# EAGLE schematic zero crossing (EAGLE 7.2.0)
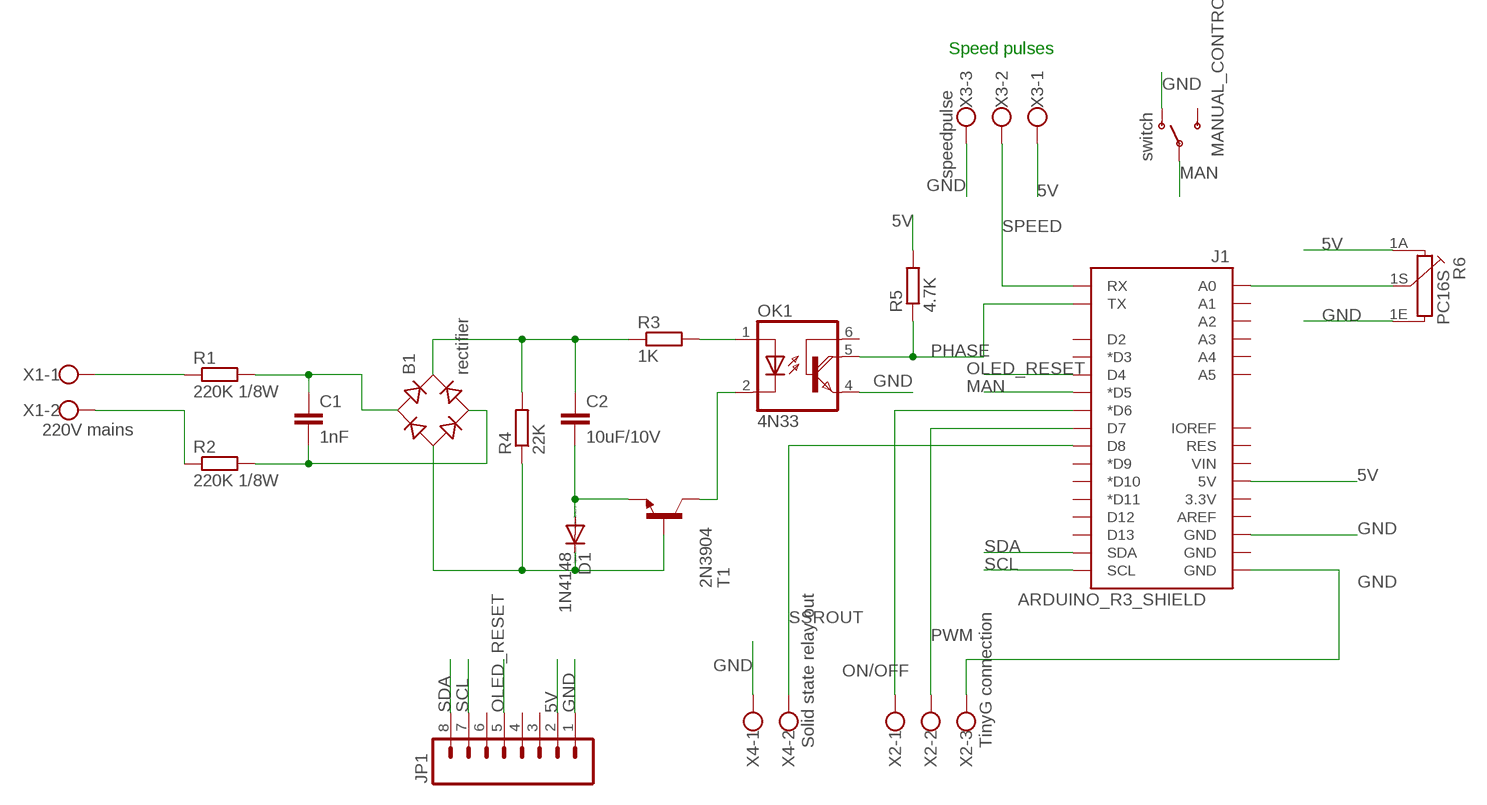
[diagram p0: schematic, sheet 1]

## Parts
B1  rectifier  RB1A  [RB1A]
C1  1nF  C-EU050-025X075  [C050-025X075]
C2  10uF/10V  C-EU050-025X075  [C050-025X075]
D1  1N4148  1N4148DO35-7  [DO35-7]
J1  ARDUINO_R3_SHIELD  [UNO_R3_SHIELD]
JP1  M08LOCK_LONGPADS  [1X08_LOCK_LONGPADS]
MANUAL_CONTROL  switch  SWITCH-SPDTPTH  [SWITCH-SPDT]
OK1  4N33  [DIL06]
R1  220K 1/8W  R-EU_0207/10  [0207/10]
R2  220K 1/8W  R-EU_0207/10  [0207/10]
R3  1K  R-EU_0207/10  [0207/10]
R4  22K  R-EU_0207/10  [0207/10]
R5  4.7K  R-EU_0207/10  [0207/10]
R6  PC16S  [PC16S]
T1  2N3904  2SC458  [TO92-ECB]
X1  220V mains  W237-102  [W237-102]
X2  TinyG connection  W237-103  [W237-103]
X3  speedpulse  W237-103  [W237-103]
X4  Solid state relay out  W237-102  [W237-102]

## Nets
5V: J1.5V JP1.2 R5.2 R6.1A X3.1
GND: J1.GND@0(GND) J1.GND@2(GND) JP1.1 MANUAL_CONTROL.1(O) OK1.4(E) R6.1E X2.3 X3.3 X4.1
MAN: J1.D5(*D5) MANUAL_CONTROL.2(P)
N$1: B1.AC1 C1.1 R1.2
N$2: B1.AC2 C1.2 R2.2
N$3: R1.1 X1.1
N$4: R2.1 X1.2
N$5: J1.A0 R6.1S
N$7: B1.- D1.C R4.1 T1.B
N$8: B1.+ C2.1 R3.1 R4.2
N$9: C2.2 D1.A T1.E
N$10: OK1.1(A) R3.2
N$11: OK1.2(C) T1.C
OLED_RESET: J1.D4 JP1.5
ON/OFF: J1.D6(*D6) X2.1
PHASE: J1.TX OK1.5(COL) R5.1
PWM: J1.D7 X2.2
SCL: J1.SCL JP1.7
SDA: J1.SDA JP1.8
SPEED: J1.RX X3.2
SSROUT: J1.D8 X4.2
Unconnected: J1.3.3V J1.A1 J1.A2 J1.A3 J1.A4 J1.A5 J1.AREF J1.D2 J1.D3(*D3) J1.D9(*D9) J1.D10(*D10) J1.D11(*D11) J1.D12 J1.D13 J1.GND@1(GND) J1.IOREF J1.RES J1.VIN JP1.3 JP1.4 JP1.6 MANUAL_CONTROL.3(S) OK1.6(B)

## Notes on the sheet
- Speed pulses

## Library data of the parts
B1 = rectifier:RB1A: RECTIFIER 1 A
C1 C2 = resistor:C-EU: CAPACITOR, European symbol
D1 = diode:1N4148: DIODE high speed (Philips)
J1 = SparkFun-Boards:ARDUINO_R3_SHIELD: Shield form compatible with the Arduino Uno R3.
JP1 = SparkFun-Connectors:M08: Header 8 Standard 8-pin 0.1" header. Use with straight break away headers (SKU : PRT-00116), right angle break away headers (PRT-00553), swiss pins (PRT-00743), machine pins (PRT-00117), and female headers (PRT-00115).
MANUAL_CONTROL = SparkFun-Electromechanical:SWITCH-SPDT: SPDT Switch Simple slide switch, Spark Fun Electronics SKU : COM-00102 DPDT SMT slide switch, AYZ0202, SWCH-08179; PROD_ID: SWCH-08261
OK1 = optocoupler:4N33: MOTOROLA OPTO COUPLER; MF: VISHAY/TELEFUNKEN; MPN: 4N33; OC_FARNELL: 1469601; OC_NEWARK: 88K1390
R1-R5 = rcl:R-EU_: RESISTOR, European symbol
R6 = piher:PC16S: POTENTIOMETER single carbon potentiometer, 16 mm, S3ROH; OC_FARNELL: 4452940; OC_NEWARK: unknown
T1 = transistor:2SC458: NPN Silicon Epitaxial Planar Transistor Source: SEMTECH ELECTRONICS LTD. ... 2SC458 1.pdf
X1 X4 = con-wago-500:W237-102: WAGO SCREW CLAMP; MPN: 237-102; OC_FARNELL: unknown; OC_NEWARK: 70K9898
X2 X3 = con-wago-500:W237-103: WAGO SCREW CLAMP; MPN: 237-103; OC_FARNELL: unknown; OC_NEWARK: 18M7116